# Altium project RX_BA_v2.PrjPcb
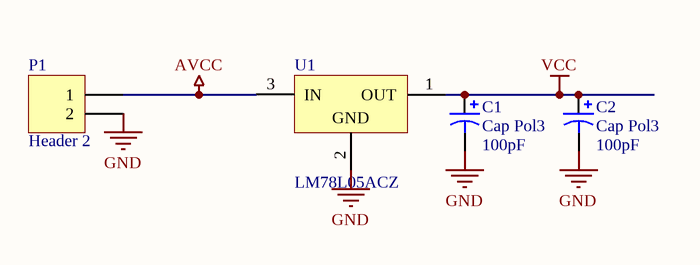
[diagram p0: Alimentacion.SchDoc]
7 sheets, 126 parts. Net scope: flat (ports and power ports of the same name join across sheets).
Board file: RXBA_v2.PcbDoc
Sheets:
  Alimentacion.SchDoc
  FiltroRF.SchDoc
  AmpliRF.SchDoc
  Mezclador1.SchDoc
  Mezclador2.SchDoc
  Ampli_FI2.SchDoc
  Ampli_audio.SchDoc

## Sheet Alimentacion.SchDoc
size A4

### Parts
C1  Cap Pol3  value 100pF  [C0805]
C2  Cap Pol3  value 100pF  [C0805]
P1  Header 2  [HDR1X2]
U1  LM78L05ACZ  [Z03A]

### Nets
AVCC: P1.1 U1.3(IN)
GND: C1.2 C2.2 P1.2 U1.2(GND)
VCC: C1.1 C2.1 U1.1(OUT)

### Library data of the parts
C1 C2 = Cap Pol3: Polarized Capacitor (Surface Mount); Published: 8-Jun-2000; LatestRevisionDate: 17-Jul-2002; LatestRevisionNote: Re-released for DXP Platform.; PackageReference: C0805; Publisher: Altium Limited
P1 = Header 2: Header, 2-Pin; LatestRevisionDate: 17-Jul-2002; LatestRevisionNote: Re-released for DXP Platform.; Publisher: Altium Limited
U1 = LM78L05ACZ: 3-Terminal Positive Regulators; Manufacturer: National Semiconductor; CompType: LDO IC; PackageTopMarking: NSXYTT*LM78L*05ACZ; Published: 27-Nov-2008; DatasheetVersion: Apr-2006; PackageVersion: revG, Sep-2000; PackageReference: Z03A; Publisher: Altium Limited; PackageDescription: TO-92, Molded, 3 Lead; PartNumber: LM78L05ACZ; RoHS: O; PinCount: 3; DigiKeyPartNumber: LM78L05ACZNS-ND; Code_JEDEC: TO-226-AA; ComponentLink1Description: LM78L05 Datasheet; ComponentLink1URL: http://www.national.com/ds/LM/LM78L05.pdf; ComponentLink2Description: LM78L05 Web Page; ComponentLink2URL: http://www.national.com/pf/LM/LM78L05.html; ComponentLink3Description: Z03A Package Page; ComponentLink3URL: http://www.national.com/packaging/folders/z03a.html

## Sheet FiltroRF.SchDoc
size A4
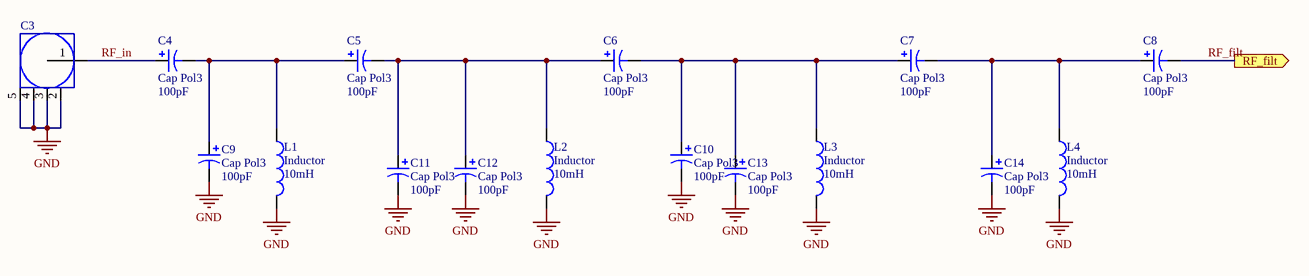
[diagram p1: FiltroRF.SchDoc]

### Parts
C3  SMA  [SMA1]  (value not drawn)
C4  Cap Pol3  value 100pF  [C0805]
C5  Cap Pol3  value 100pF  [C0805]
C6  Cap Pol3  value 100pF  [C0805]
C7  Cap Pol3  value 100pF  [C0805]
C8  Cap Pol3  value 100pF  [C0805]
C9  Cap Pol3  value 100pF  [C0805]
C10  Cap Pol3  value 100pF  [C0805]
C11  Cap Pol3  value 100pF  [C0805]
C12  Cap Pol3  value 100pF  [C0805]
C13  Cap Pol3  value 100pF  [C0805]
C14  Cap Pol3  value 100pF  [C0805]
L1  Inductor  value 10mH  [3261]
L2  Inductor  value 10mH  [3261]
L3  Inductor  value 10mH  [3261]
L4  Inductor  value 10mH  [3261]

### Ports
RF_filt (out)

### Nets
GND: C3.2(GND) C3.3(GND) C3.4(GND) C3.5(GND) C9.2 C10.2 C11.2 C12.2 C13.2 C14.2 L1.2 L2.2 L3.2 L4.2
RF_filt: C8.2 ; port RF_filt
RF_in: C3.1(RF) C4.1
NetC4_2: C4.2 C5.1 C9.1 L1.1
NetC5_2: C5.2 C6.1 C11.1 C12.1 L2.1
NetC6_2: C6.2 C7.1 C10.1 C13.1 L3.1
NetC7_2: C7.2 C8.1 C14.1 L4.1

### Library data of the parts
C4-C14 = Cap Pol3: Polarized Capacitor (Surface Mount); Published: 8-Jun-2000; LatestRevisionDate: 17-Jul-2002; LatestRevisionNote: Re-released for DXP Platform.; PackageReference: C0805; Publisher: Altium Limited
L1-L4 = Inductor: Code_IEC: 1005; Published: 8-Jun-2000; LatestRevisionDate: 17-Jul-2002; LatestRevisionNote: Re-released for DXP Platform.; PackageReference: 0402-A; Publisher: Altium Limited; Code_JEITA: 0402

## Sheet AmpliRF.SchDoc
size A4
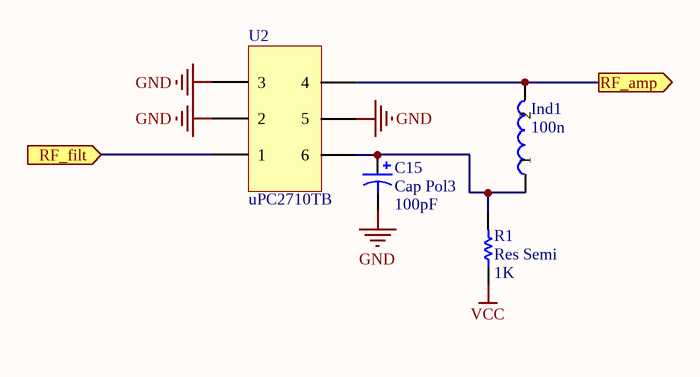
[diagram p2: AmpliRF.SchDoc]

### Parts
C15  Cap Pol3  value 100pF  [C0805]
Ind1  Valor: 100n  [NTH12_2]  (hidden comment: Ind2)
R1  Res Semi  value 1K  [2012[0805]]
U2  uPC2710TB  [UPC2710TB2]

### Ports
RF_amp (out), RF_filt (in)

### Nets
GND: C15.2 U2.GND1(2) U2.GND2(3) U2.GND3(5)
VCC: R1.1
RF_amp: Ind1.2 U2.RF_OUT(4) ; port RF_amp
RF_filt: U2.RF_IN(1) ; port RF_filt
NetC15_1: C15.1 Ind1.1 R1.2 U2.Vcc(6)

### Library data of the parts
C15 = Cap Pol3: Polarized Capacitor (Surface Mount); Published: 8-Jun-2000; LatestRevisionDate: 17-Jul-2002; LatestRevisionNote: Re-released for DXP Platform.; PackageReference: C0805; Publisher: Altium Limited
R1 = Res Semi: Semiconductor Resistor; Published: 8-Jun-2000; LatestRevisionDate: 17-Jul-2002; LatestRevisionNote: Re-released for DXP Platform.; PackageReference: AXIAL-0.5; Publisher: Altium Limited
U2 = uPC2710TB: pin to pad: GND1>2 GND2>3 GND3>5 RF_IN>1 RF_OUT>4 Vcc>6

## Sheet Mezclador1.SchDoc
size A4
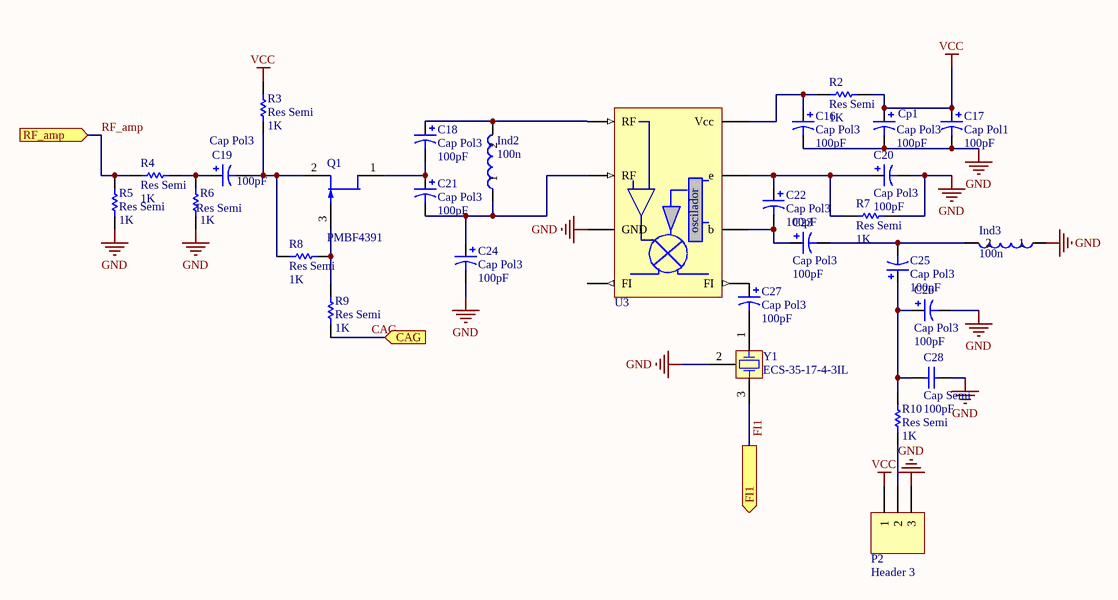
[diagram p3: Mezclador1.SchDoc]

### Parts
C16  Cap Pol3  value 100pF  [C0805]
C17  Cap Pol1  value 100pF  [B]
C18  Cap Pol3  value 100pF  [C0805]
C19  Cap Pol3  value 100pF  [C0805]
C20  Cap Pol3  value 100pF  [C0805]
C21  Cap Pol3  value 100pF  [C0805]
C22  Cap Pol3  value 100pF  [C0805]
C23  Cap Pol3  value 100pF  [C0805]
C24  Cap Pol3  value 100pF  [C0805]
C25  Cap Pol3  value 100pF  [C0805]
C26  Cap Pol3  value 100pF  [C0805]
C27  Cap Pol3  value 100pF  [C0805]
C28  Cap Semi  value 100pF  [C1206]
Cp1  Cap Pol3  value 100pF  [C0805]
Ind2  Valor: 100n  [Ind_5mm]  (hidden comment: Ind2)
Ind3  Valor: 100n  [Ind_4mm]  (hidden comment: Ind2)
P2  Header 3  [HDR1X3]
Q1  PMBF4391  [SOT23_N]
R2  Res Semi  value 1K  [2012[0805]]
R3  Res Semi  value 1K  [2012[0805]]
R4  Res Semi  value 1K  [2012[0805]]
R5  Res Semi  value 1K  [2012[0805]]
R6  Res Semi  value 1K  [2012[0805]]
R7  Res Semi  value 1K  [2012[0805]]
R8  Res Semi  value 1K  [2012[0805]]
R9  Res Semi  value 1K  [2012[0805]]
R10  Res Semi  value 1K  [2012[0805]]
U3  SA602  [SA602]  (value not drawn)
Y1  ECS-35-17-4-3IL  [HC-49US]

### Ports
CAG (in), FI1 (out), RF_amp (in)

### Nets
GND: C16.2 C17.2 C20.2 C24.2 C26.2 C28.2 Cp1.2 Ind3.1 P2.3 R5.1 R6.1 R7.1 U3.3(GND) Y1.2(COM)
VCC: C17.1 Cp1.1 P2.1 R2.2 R3.2
CAG: R9.2 ; port CAG
FI1: Y1.3(OSC2) ; port FI1
RF_amp: R4.1 R5.2 ; port RF_amp
NetC16_1: C16.1 R2.1 U3.8(Vcc)
NetC18_1: C18.1 Ind2.2 U3.1(RF)
NetC18_2: C18.2 C21.1 Q1.1(D)
NetC19_1: C19.1 R4.2 R6.2
NetC19_2: C19.2 Q1.2(S) R3.1 R8.1
NetC20_1: C20.1 C22.1 R7.2 U3.7(e)
NetC21_2: C21.2 C24.1 Ind2.1 U3.2(RF)
NetC22_2: C22.2 C23.1 U3.6(b)
NetC23_2: C23.2 C25.2 Ind3.2
NetC25_1: C25.1 C26.1 C28.1 R10.2
NetC27_1: C27.1 U3.5(FI)
NetC27_2: C27.2 Y1.1(OSC1)
NetP2_2: P2.2 R10.1
NetQ1_3: Q1.3(G) R8.2 R9.1

Not connected (* = marked no-connect by the designer): U3 4(FI)

### Notes on the sheet
- (in symbol SA602A) oscilador

### Library data of the parts
C16 C18-C27 Cp1 = Cap Pol3: Polarized Capacitor (Surface Mount); Published: 8-Jun-2000; LatestRevisionDate: 17-Jul-2002; LatestRevisionNote: Re-released for DXP Platform.; PackageReference: C0805; Publisher: Altium Limited
C17 = Cap Pol1: Polarized Capacitor (Radial); Published: 8-Jun-2000; LatestRevisionDate: 17-Jul-2002; LatestRevisionNote: Re-released for DXP Platform.; PackageReference: RB7.6-15; Publisher: Altium Limited
C28 = Cap Semi: Capacitor (Semiconductor SIM Model); Published: 8-Jun-2000; LatestRevisionDate: 17-Jul-2002; LatestRevisionNote: Re-released for DXP Platform.; PackageReference: C1206; Publisher: Altium Limited
P2 = Header 3: Header, 3-Pin; LatestRevisionDate: 17-Jul-2002; LatestRevisionNote: Re-released for DXP Platform.; Publisher: Altium Limited
Q1 = PMBF4391: N-channel Silicon Junction Field-effect Transistor; Published: 17-Sep-2003; LatestRevisionDate: 12-Dec-2006; LatestRevisionNote: IPC-7351 Footprint Added.; DatasheetVersion: Apr-1995; PackageVersion: May-1999; PackageReference: SOT23; Publisher: Altium Limited; PackageDescription: 3-Pin SOT-23 Package 0.95 mm Pitch, 2.3 mm Lead Span; ComponentLink1Description: Manufacturer Link; ComponentLink1URL: http://www.semiconductors.philips.com/; ComponentLink2Description: Datasheet; ComponentLink2URL: http://www.semiconductors.philips.com/acrobat/datasheets/PMBF4391_4392_4393_CNV_2.pdf
R2-R10 = Res Semi: Semiconductor Resistor; Published: 8-Jun-2000; LatestRevisionDate: 17-Jul-2002; LatestRevisionNote: Re-released for DXP Platform.; PackageReference: AXIAL-0.5; Publisher: Altium Limited
U3 = SA602A: Mezclador 500MHz
Y1 = ECS-35-17-4-3IL: Crystal Oscillator, 3rd In-Line Lead Version; Published: 17-Jul-2002; DatasheetDocument: 18-Apr-2000; PackageReference: HC-49US; Publisher: Altium Limited; ComponentLink1Description: Manufacturer Link; ComponentLink1URL: http://www.ecsxtal.com/; ComponentLink2Description: Datasheet; ComponentLink2URL: http://www.ecsxtal.com/pdf3/HC_49US.pdf

## Sheet Mezclador2.SchDoc
size A4
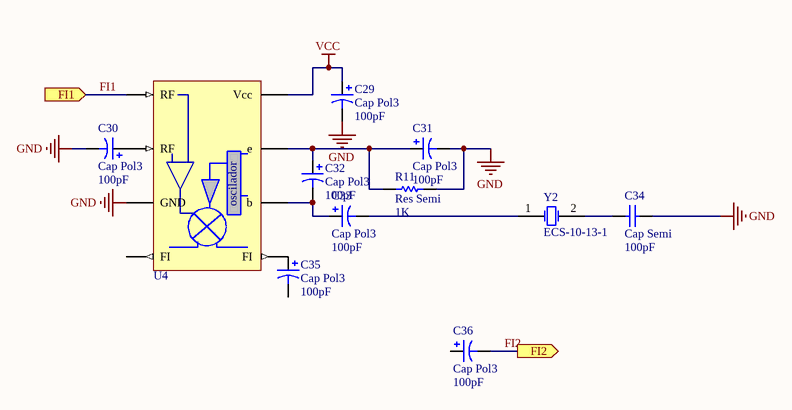
[diagram p4: Mezclador2.SchDoc]

### Parts
C29  Cap Pol3  value 100pF  [C0805]
C30  Cap Pol3  value 100pF  [C0805]
C31  Cap Pol3  value 100pF  [C0805]
C32  Cap Pol3  value 100pF  [C0805]
C33  Cap Pol3  value 100pF  [C0805]
C34  Cap Semi  value 100pF  [C1206]
C35  Cap Pol3  value 100pF  [C0805]
C36  Cap Pol3  value 100pF  [C0805]
R11  Res Semi  value 1K  [2012[0805]]
U4  SA602  [SA602]  (value not drawn)
Y2  ECS-10-13-1  [HC-49U]

### Ports
FI1 (in), FI2 (out)

### Nets
GND: C29.2 C30.2 C31.2 C34.2 R11.1 U4.3(GND)
VCC: C29.1 U4.8(Vcc)
FI1: U4.1(RF) ; port FI1
FI2: C36.2 ; port FI2
NetC30_1: C30.1 U4.2(RF)
NetC31_1: C31.1 C32.1 R11.2 U4.7(e)
NetC32_2: C32.2 C33.1 U4.6(b)
NetC33_2: C33.2 Y2.1(OSC1)
NetC34_1: C34.1 Y2.2(OSC2)
NetC35_1: C35.1 U4.5(FI)

Not connected (* = marked no-connect by the designer): C35 2; C36 1; U4 4(FI)

### Notes on the sheet
- (in symbol SA602A) oscilador

### Library data of the parts
C29-C33 C35 C36 = Cap Pol3: Polarized Capacitor (Surface Mount); Published: 8-Jun-2000; LatestRevisionDate: 17-Jul-2002; LatestRevisionNote: Re-released for DXP Platform.; PackageReference: C0805; Publisher: Altium Limited
C34 = Cap Semi: Capacitor (Semiconductor SIM Model); Published: 8-Jun-2000; LatestRevisionDate: 17-Jul-2002; LatestRevisionNote: Re-released for DXP Platform.; PackageReference: C1206; Publisher: Altium Limited
R11 = Res Semi: Semiconductor Resistor; Published: 8-Jun-2000; LatestRevisionDate: 17-Jul-2002; LatestRevisionNote: Re-released for DXP Platform.; PackageReference: AXIAL-0.5; Publisher: Altium Limited
U4 = SA602A: Mezclador 500MHz
Y2 = ECS-10-13-1: Crystal Oscillator; Published: 17-Jul-2002; DatasheetDocument: 18-Apr-2000; PackageReference: HC-49U; Publisher: Altium Limited; ComponentLink1Description: Manufacturer Link; ComponentLink1URL: http://www.ecsxtal.com/; ComponentLink2Description: Datasheet; ComponentLink2URL: http://www.ecsxtal.com/pdf2/HC49U.PDF

## Sheet Ampli_FI2.SchDoc
size A4
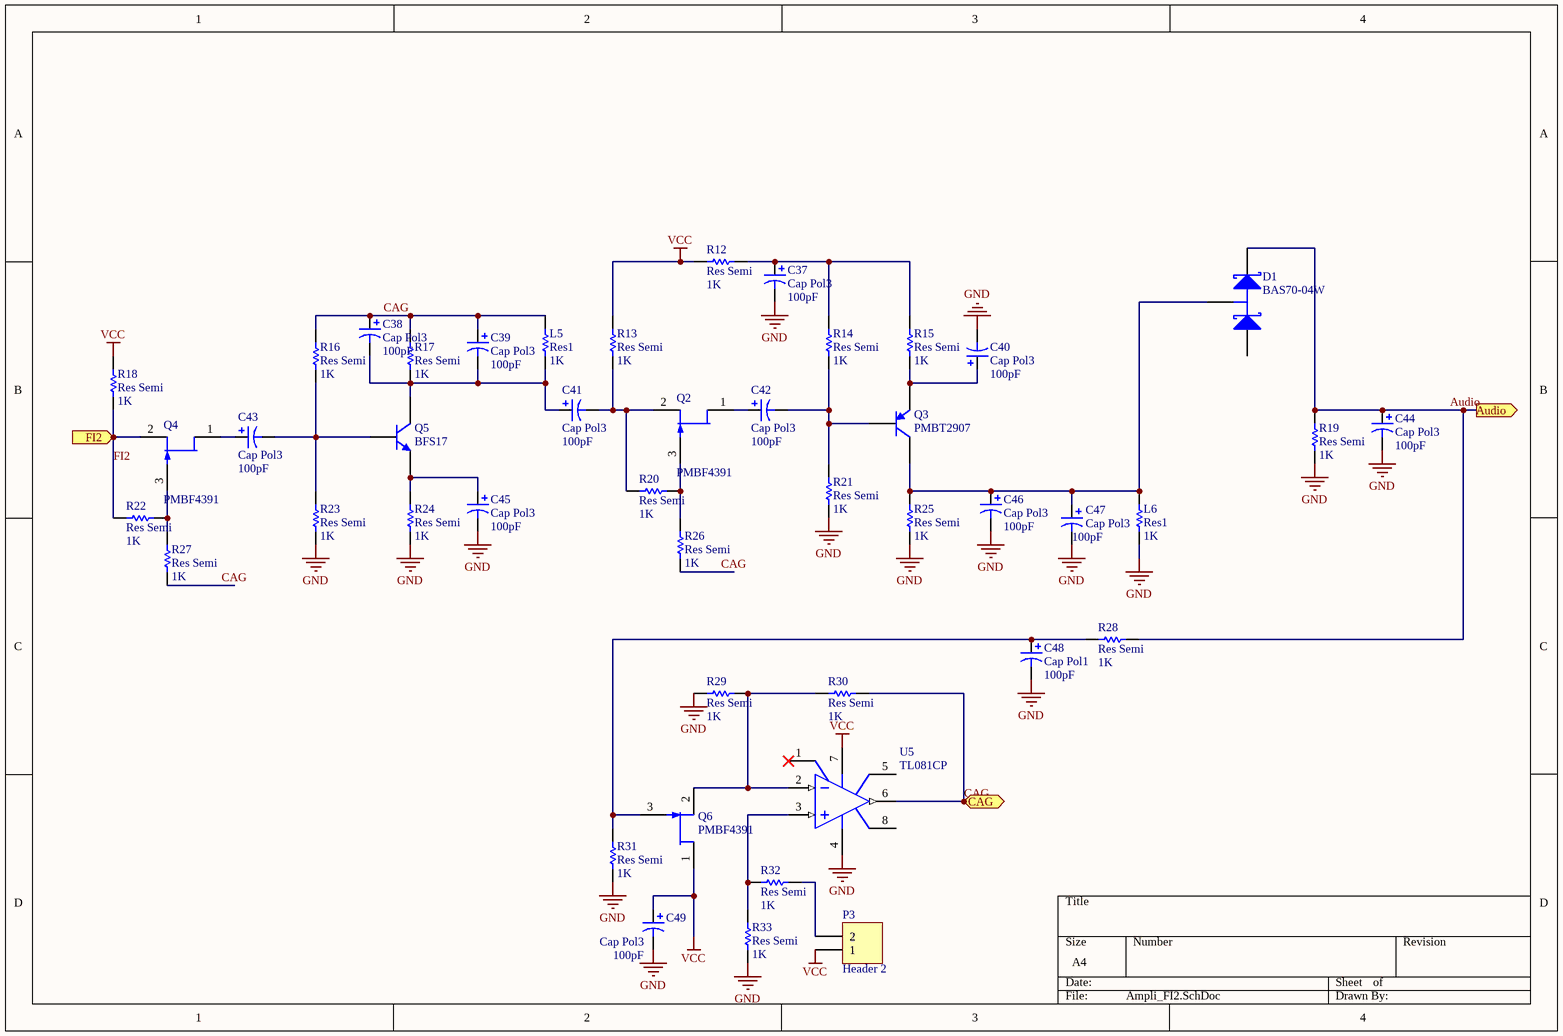
[diagram p5: Ampli_FI2.SchDoc]

### Parts
C37  Cap Pol3  value 100pF  [C0805]
C38  Cap Pol3  value 100pF  [C0805]
C39  Cap Pol3  value 100pF  [C0805]
C40  Cap Pol3  value 100pF  [C0805]
C41  Cap Pol3  value 100pF  [C0805]
C42  Cap Pol3  value 100pF  [C0805]
C43  Cap Pol3  value 100pF  [C0805]
C44  Cap Pol3  value 100pF  [C0805]
C45  Cap Pol3  value 100pF  [C0805]
C46  Cap Pol3  value 100pF  [C0805]
C47  Cap Pol3  value 100pF  [C0805]
C48  Cap Pol1  value 100pF  [B]
C49  Cap Pol3  value 100pF  [C0805]
D1  BAS70-04W  [SOT323_N]
L5  Res1  value 1K  [AXIAL-0.3]
L6  Res1  value 1K  [AXIAL-0.3]
P3  Header 2  [HDR1X2]
Q2  PMBF4391  [SOT23_N]
Q3  PMBT2907  [SOT23_N]
Q4  PMBF4391  [SOT23_N]
Q5  BFS17  [SOT23_N]
Q6  PMBF4391  [SOT23_N]
R12  Res Semi  value 1K  [2012[0805]]
R13  Res Semi  value 1K  [2012[0805]]
R14  Res Semi  value 1K  [2012[0805]]
R15  Res Semi  value 1K  [2012[0805]]
R16  Res Semi  value 1K  [2012[0805]]
R17  Res Semi  value 1K  [2012[0805]]
R18  Res Semi  value 1K  [2012[0805]]
R19  Res Semi  value 1K  [2012[0805]]
R20  Res Semi  value 1K  [2012[0805]]
R21  Res Semi  value 1K  [2012[0805]]
R22  Res Semi  value 1K  [2012[0805]]
R23  Res Semi  value 1K  [2012[0805]]
R24  Res Semi  value 1K  [2012[0805]]
R25  Res Semi  value 1K  [2012[0805]]
R26  Res Semi  value 1K  [2012[0805]]
R27  Res Semi  value 1K  [2012[0805]]
R28  Res Semi  value 1K  [2012[0805]]
R29  Res Semi  value 1K  [2012[0805]]
R30  Res Semi  value 1K  [2012[0805]]
R31  Res Semi  value 1K  [2012[0805]]
R32  Res Semi  value 1K  [2012[0805]]
R33  Res Semi  value 1K  [2012[0805]]
U5  TL081CP  [626-05]

### Ports
Audio (out), CAG (out), FI2 (in)

### Nets
GND: C37.2 C40.2 C44.2 C45.2 C46.2 C47.2 C48.2 C49.2 L6.1 R19.1 R21.2 R23.1 R24.1 R25.2 R29.1 R31.2 R33.2 U5.4(V-)
VCC: C49.1 P3.1 Q6.1(D) R12.2 R13.2 R18.1 U5.7(V+)
Audio: C44.1 D1.2(K) R19.2 R28.1 ; port Audio
CAG: C38.1 C39.1 L5.2 R16.2 R17.2 R26.2 R27.2 R30.2 U5.6(OUT) ; port CAG
FI2: Q4.2(S) R18.2 R22.1 ; port FI2
NetC37_1: C37.1 R12.1 R14.1 R15.1
NetC38_2: C38.2 C39.2 C41.1 L5.1 Q5.3(C) R17.1
NetC40_1: C40.1 Q3.2(E) R15.2
NetC41_2: C41.2 Q2.2(S) R13.1 R20.1
NetC42_1: C42.1 Q2.1(D)
NetC42_2: C42.2 Q3.1(B) R14.2 R21.1
NetC43_1: C43.1 Q4.1(D)
NetC43_2: C43.2 Q5.1(B) R16.1 R23.2
NetC45_1: C45.1 Q5.2(E) R24.2
NetC46_1: C46.1 C47.1 D1.3(C) L6.2 Q3.3(C) R25.1
NetC48_1: C48.1 Q6.3(G) R28.2 R31.1
NetP3_2: P3.2 R32.1
NetQ2_3: Q2.3(G) R20.2 R26.1
NetQ4_3: Q4.3(G) R22.2 R27.1
NetQ6_2: Q6.2(S) R29.2 R30.1 U5.2(IN-)
NetR32_2: R32.2 R33.1 U5.3(IN+)

Not connected (* = marked no-connect by the designer): D1 1(A); U5 1(OS_NULL)* 5(OS_NULL) 8(NC)

### Library data of the parts
C37-C47 C49 = Cap Pol3: Polarized Capacitor (Surface Mount); Published: 8-Jun-2000; LatestRevisionDate: 17-Jul-2002; LatestRevisionNote: Re-released for DXP Platform.; PackageReference: C0805; Publisher: Altium Limited
C48 = Cap Pol1: Polarized Capacitor (Radial); Published: 8-Jun-2000; LatestRevisionDate: 17-Jul-2002; LatestRevisionNote: Re-released for DXP Platform.; PackageReference: RB7.6-15; Publisher: Altium Limited
D1 = BAS70-04W: Schottky Barrier Double Diode; Published: 17-Sep-2003; LatestRevisionDate: 12-Dec-2006; LatestRevisionNote: IPC-7351 Footprint Added.; DatasheetVersion: 26-Mar-1999; PackageVersion: Apr-1999; PackageReference: SOT323; Publisher: Altium Limited; PackageDescription: 3-Pin SOT-323 Package 0.65 mm Pitch, 2.1 mm Lead Span; ComponentLink1Description: Manufacturer Link; ComponentLink1URL: http://www.semiconductors.philips.com/; ComponentLink2Description: Datasheet; ComponentLink2URL: http://www.semiconductors.philips.com/acrobat/datasheets/BAS70W_3.pdf
L5 L6 = Res1: Resistor; Published: 8-Jun-2000; LatestRevisionDate: 17-Jul-2002; LatestRevisionNote: Re-released for DXP Platform.; PackageReference: AXIAL-0.3; Publisher: Altium Limited
P3 = Header 2: Header, 2-Pin; LatestRevisionDate: 17-Jul-2002; LatestRevisionNote: Re-released for DXP Platform.; Publisher: Altium Limited
Q2 Q4 Q6 = PMBF4391: as Q1 on sheet Mezclador1; Published: 17-Sep-2003; LatestRevisionDate: 12-Dec-2006; LatestRevisionNote: IPC-7351 Footprint Added.; DatasheetVersion: Apr-1995; PackageVersion: May-1999; PackageReference: SOT23; Publisher: Altium Limited; PackageDescription: 3-Pin SOT-23 Package 0.95 mm Pitch, 2.3 mm Lead Span; ComponentLink1Description: Manufacturer Link; ComponentLink1URL: http://www.semiconductors.philips.com/; ComponentLink2Description: Datasheet; ComponentLink2URL: http://www.semiconductors.philips.com/acrobat/datasheets/PMBF4391_4392_4393_CNV_2.pdf
Q3 = PMBT2907: PNP Switching Transistor; Published: 17-Sep-2003; LatestRevisionDate: 12-Dec-2006; LatestRevisionNote: IPC-7351 Footprint Added.; DatasheetVersion: 27-Apr-1999; PackageVersion: May-1999; PackageReference: SOT23; Publisher: Altium Limited; PackageDescription: 3-Pin SOT-23 Package 0.95 mm Pitch, 2.3 mm Lead Span; ComponentLink1Description: Manufacturer Link; ComponentLink1URL: http://www.semiconductors.philips.com/; ComponentLink2Description: Datasheet; ComponentLink2URL: http://www.semiconductors.philips.com/acrobat/datasheets/PMBT2907_PMBT2907A_5.pdf
Q5 = BFS17: NPN 1 GHz Wideband Transistor; Published: 17-Sep-2003; LatestRevisionDate: 12-Dec-2006; LatestRevisionNote: IPC-7351 Footprint Added.; DatasheetVersion: Sep-1995; PackageVersion: May-1999; PackageReference: SOT23; Publisher: Altium Limited; PackageDescription: 3-Pin SOT-23 Package 0.95 mm Pitch, 2.3 mm Lead Span; ComponentLink1Description: Manufacturer Link; ComponentLink1URL: http://www.semiconductors.philips.com/; ComponentLink2Description: Datasheet; ComponentLink2URL: http://www.semiconductors.philips.com/acrobat/datasheets/BFS17_2.pdf
R12-R33 = Res Semi: Semiconductor Resistor; Published: 8-Jun-2000; LatestRevisionDate: 17-Jul-2002; LatestRevisionNote: Re-released for DXP Platform.; PackageReference: AXIAL-0.5; Publisher: Altium Limited
U5 = TL081CP: JFET-Input Operational Amplifier; Published: 17-Jul-2002; LatestRevisionDate: 06-Jun-2005; LatestRevisionNote: Stylized 3D Model Added.; DatasheetVersion: 1988; PackageReference: 626-05; Publisher: Altium Limited; PackageDescription: DIP; 8 Leads; Row Spacing 7.62 mm; Pitch 2.54 mm; ComponentLink1Description: Manufacturer Link; ComponentLink1URL: http://www.onsemi.com/site/products/parametrics/0,4446,251,00.html

## Sheet Ampli_audio.SchDoc
size A4
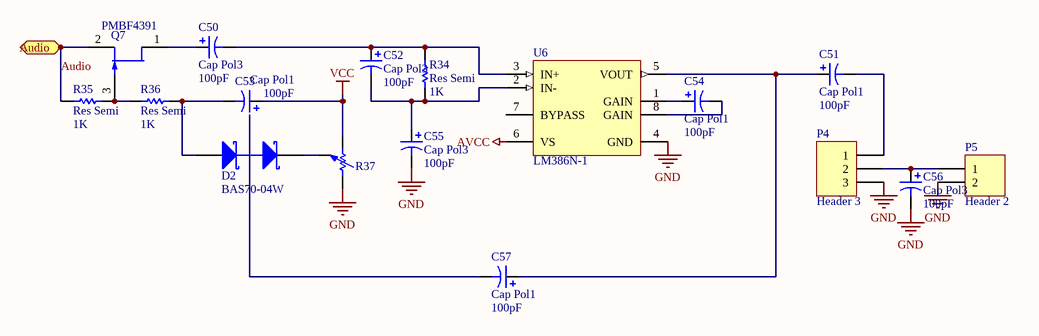
[diagram p6: Ampli_audio.SchDoc]

### Parts
C50  Cap Pol3  value 100pF  [C0805]
C51  Cap Pol1  value 100pF  [B]
C52  Cap Pol3  value 100pF  [C0805]
C53  Cap Pol1  value 100pF  [B]
C54  Cap Pol1  value 100pF  [B]
C55  Cap Pol3  value 100pF  [C0805]
C56  Cap Pol3  value 100pF  [C0805]
C57  Cap Pol1  value 100pF  [B]
D2  BAS70-04W  [SOT323_N]
P4  Header 3  [HDR1X3]
P5  Header 2  [HDR1X2]
Q7  PMBF4391  [SOT23_N]
R34  Res Semi  value 1K  [2012[0805]]
R35  Res Semi  value 1K  [2012[0805]]
R36  Res Semi  value 1K  [2012[0805]]
R37  Pot  [Potenciometro]  (value not drawn)
U6  LM386N-1  [N08E]

### Ports
Audio (in)

### Nets
AVCC: U6.6(VS)
GND: C55.2 C56.2 P4.3 P5.2 R37.1 U6.4(GND)
VCC: C53.1 R37.2
Audio: Q7.2(S) R35.1 ; port Audio
NetC50_1: C50.1 Q7.1(D)
NetC50_2: C50.2 C52.1 R34.2 U6.3(IN+)
NetC51_1: C51.1 C57.1 U6.5(VOUT)
NetC51_2: C51.2 P4.1
NetC52_2: C52.2 C55.1 R34.1 U6.2(IN-)
NetC53_2: C53.2 D2.1(A) R36.2
NetC54_1: C54.1 U6.1(GAIN)
NetC54_2: C54.2 U6.8(GAIN)
NetC56_1: C56.1 P4.2 P5.1
NetC57_2: C57.2 D2.3(C)
NetD2_2: D2.2(K) R37.3
NetQ7_3: Q7.3(G) R35.2 R36.1

Not connected (* = marked no-connect by the designer): U6 7(BYPASS)

### Library data of the parts
C50 C52 C55 C56 = Cap Pol3: Polarized Capacitor (Surface Mount); Published: 8-Jun-2000; LatestRevisionDate: 17-Jul-2002; LatestRevisionNote: Re-released for DXP Platform.; PackageReference: C0805; Publisher: Altium Limited
C51 C53 C54 C57 = Cap Pol1: Polarized Capacitor (Radial); Published: 8-Jun-2000; LatestRevisionDate: 17-Jul-2002; LatestRevisionNote: Re-released for DXP Platform.; PackageReference: RB7.6-15; Publisher: Altium Limited
D2 = BAS70-04W: Schottky Barrier Double Diode; Published: 17-Sep-2003; LatestRevisionDate: 12-Dec-2006; LatestRevisionNote: IPC-7351 Footprint Added.; DatasheetVersion: 26-Mar-1999; PackageVersion: Apr-1999; PackageReference: SOT323; Publisher: Altium Limited; PackageDescription: 3-Pin SOT-323 Package 0.65 mm Pitch, 2.1 mm Lead Span; ComponentLink1Description: Manufacturer Link; ComponentLink1URL: http://www.semiconductors.philips.com/; ComponentLink2Description: Datasheet; ComponentLink2URL: http://www.semiconductors.philips.com/acrobat/datasheets/BAS70W_3.pdf
P4 = Header 3: Header, 3-Pin; LatestRevisionDate: 17-Jul-2002; LatestRevisionNote: Re-released for DXP Platform.; Publisher: Altium Limited
P5 = Header 2: Header, 2-Pin; LatestRevisionDate: 17-Jul-2002; LatestRevisionNote: Re-released for DXP Platform.; Publisher: Altium Limited
Q7 = PMBF4391: as Q1 on sheet Mezclador1; Published: 17-Sep-2003; LatestRevisionDate: 12-Dec-2006; LatestRevisionNote: IPC-7351 Footprint Added.; DatasheetVersion: Apr-1995; PackageVersion: May-1999; PackageReference: SOT23; Publisher: Altium Limited; PackageDescription: 3-Pin SOT-23 Package 0.95 mm Pitch, 2.3 mm Lead Span; ComponentLink1Description: Manufacturer Link; ComponentLink1URL: http://www.semiconductors.philips.com/; ComponentLink2Description: Datasheet; ComponentLink2URL: http://www.semiconductors.philips.com/acrobat/datasheets/PMBF4391_4392_4393_CNV_2.pdf
R34-R36 = Res Semi: Semiconductor Resistor; Published: 8-Jun-2000; LatestRevisionDate: 17-Jul-2002; LatestRevisionNote: Re-released for DXP Platform.; PackageReference: AXIAL-0.5; Publisher: Altium Limited
U6 = LM386N-1: Low Voltage Audio Power Amplifier; Manufacturer: National Semiconductor; CompType: Audio IC; PackageTopMarking: NSUZXYTT*LM*386N-1; Published: 27-Nov-2008; DatasheetVersion: Aug-2000; PackageVersion: revG, May-2006; PackageReference: N08E; PackageDescription: MDIP, .365 x .250 x .130in, 8 Lead, .100in Pitch; PartNumber: LM386N-1; RoHS: O; PinCount: 8; DigiKeyPartNumber: LM386N-1-ND; Code_JEDEC: MS-001-BA; ComponentLink1Description: LM386 Datasheet; ComponentLink1URL: http://www.national.com/ds/LM/LM386.pdf; ComponentLink2Description: LM386 Web Page; ComponentLink2URL: http://www.national.com/pf/LM/LM386.html; ComponentLink3Description: N08E Package Page; ComponentLink3URL: http://www.national.com/packaging/folders/n08e.html

## Nets that join several sheets
AVCC: Alimentacion (P1.1 U1.3), Ampli_audio (U6.6)
GND: Alimentacion (C1.2 C2.2 P1.2 U1.2), FiltroRF (14 pins), AmpliRF (C15.2 U2.GND1 U2.GND2 U2.GND3), Mezclador1 (14 pins), Mezclador2 (6 pins), Ampli_FI2 (18 pins), Ampli_audio (6 pins)
VCC: Alimentacion (C1.1 C2.1 U1.1), AmpliRF (R1.1), Mezclador1 (5 pins), Mezclador2 (C29.1 U4.8), Ampli_FI2 (7 pins), Ampli_audio (C53.1 R37.2)
Audio: Ampli_FI2 (C44.1 D1.2 R19.2 R28.1), Ampli_audio (Q7.2 R35.1)
CAG: Mezclador1 (R9.2), Ampli_FI2 (9 pins)
FI1: Mezclador1 (Y1.3), Mezclador2 (U4.1)
FI2: Mezclador2 (C36.2), Ampli_FI2 (Q4.2 R18.2 R22.1)
RF_amp: AmpliRF (Ind1.2 U2.RF_OUT), Mezclador1 (R4.1 R5.2)
RF_filt: FiltroRF (C8.2), AmpliRF (U2.RF_IN)